# Altium schematic sheet Sheet2_Power_Supply.SchDoc: =ProjectName
size A4; DocumentNumber: 2; SheetNumber: 2; SheetTotal: 5
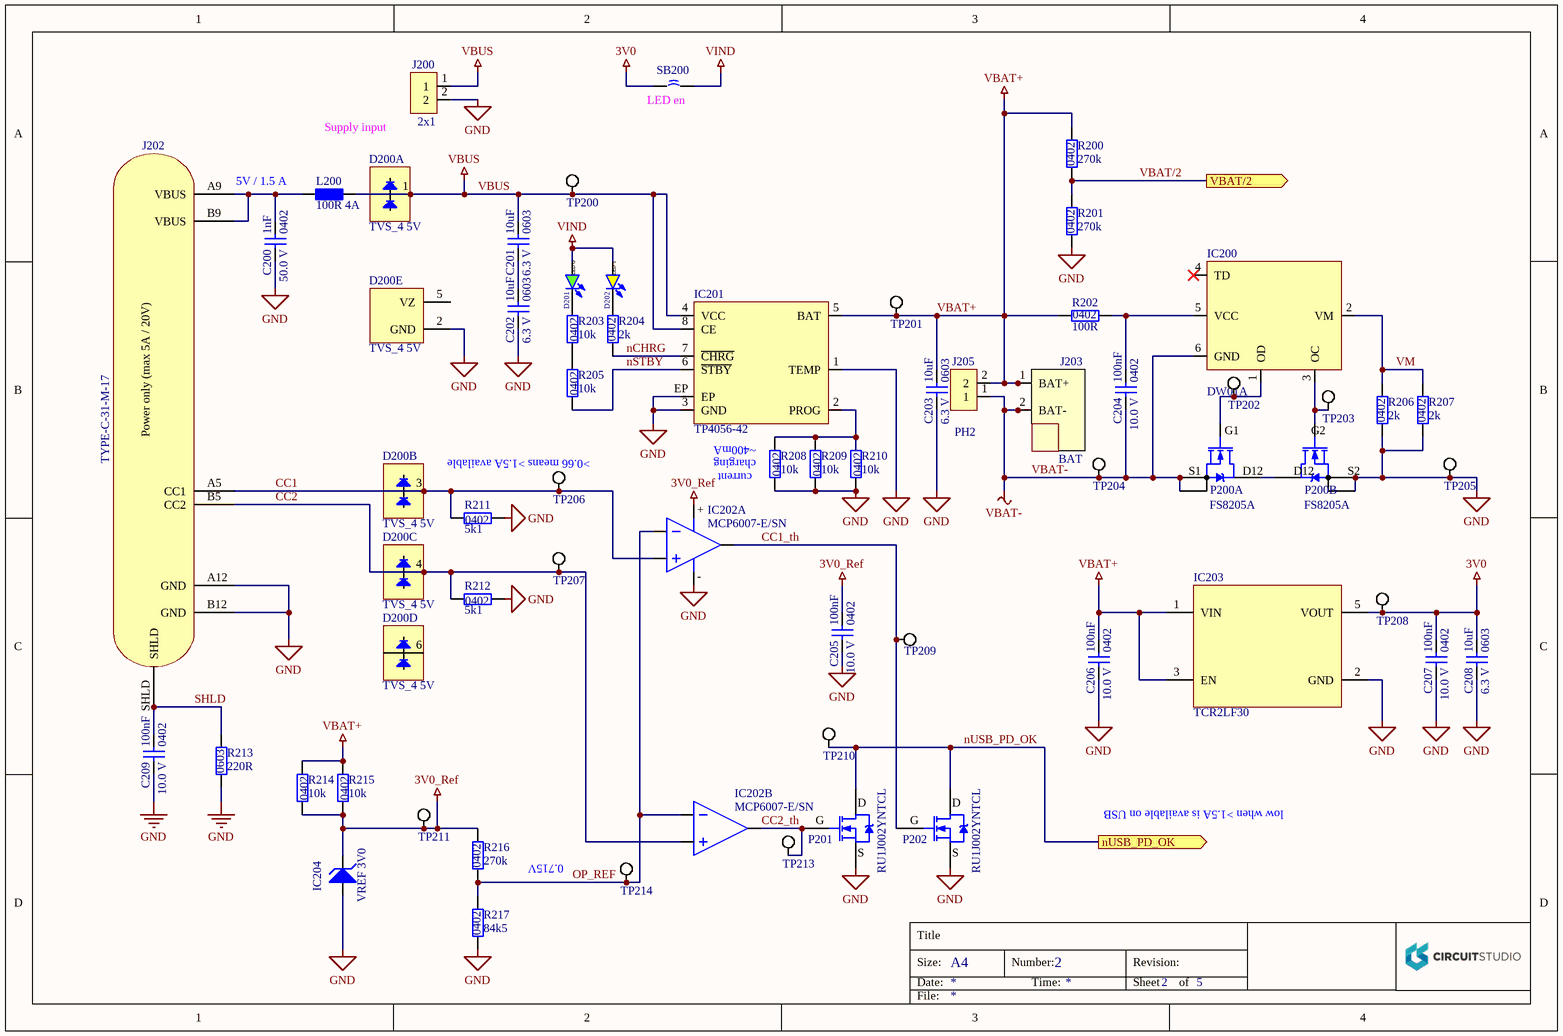
[diagram p0: Sheet2_Power_Supply.SchDoc]

## Parts
C200  Capacitance: 1nF  Footprint: 0402  Voltage: 50.0 V  [C_0402]  (hidden comment: C 1nF 0402 50V)
C201  Capacitance: 10uF  Footprint: 0603  Voltage: 6.3 V  [C_0603]  (hidden comment: C 10uF 0603 6.3V)
C202  Capacitance: 10uF  Footprint: 0603  Voltage: 6.3 V  [C_0603]  (hidden comment: C 10uF 0603 6.3V)
C203  Capacitance: 10uF  Footprint: 0603  Voltage: 6.3 V  [C_0603]  (hidden comment: C 10uF 0603 6.3V)
C204  Capacitance: 100nF  Footprint: 0402  Voltage: 10.0 V  [C_0402]  (hidden comment: C 100nF 0402 10V)
C205  Capacitance: 100nF  Footprint: 0402  Voltage: 10.0 V  [C_0402]  (hidden comment: C 100nF 0402 10V)
C206  Capacitance: 100nF  Footprint: 0402  Voltage: 10.0 V  [C_0402]  (hidden comment: C 100nF 0402 10V)
C207  Capacitance: 100nF  Footprint: 0402  Voltage: 10.0 V  [C_0402]  (hidden comment: C 100nF 0402 10V)
C208  Capacitance: 10uF  Footprint: 0603  Voltage: 6.3 V  [C_0603]  (hidden comment: C 10uF 0603 6.3V)
C209  Capacitance: 100nF  Footprint: 0402  Voltage: 10.0 V  [C_0402]  (hidden comment: C 100nF 0402 10V)
D200  TVS_4 5V  [SOT-23-6]  (parts A,B,C,D,E of 5)
D201  LED G  [LED_0603]
D202  LED Y  [LED_0603]
IC200  DW01A  [SOT-23-6]
IC201  TP4056-42  [SOIC-8-EP]
IC202  MCP6007-E/SN  [SOIC-8]  (parts A,B of 2)
IC203  TCR2LF30  [SOT-23-5]
IC204  VREF 3V0  [SOT-23-3]
J200  2x1  [PH_1x2]
J202  TYPE-C-31-M-17  [Con_TYPE-C-31-M-17]
J203  BAT  [J_BAT_CLIP_18650]
J204  BAT  (value not drawn)  (mechanical)
J205  PH2  [J_S2B-PH-K-S]
L200  Inductance: 100R 4A  [L_1206]  (hidden comment: L Ferrite 100R 4A)
P200  Manufacturer Part Number: FS8205A  [TSSOP-8_4.4mm]  (hidden comment: P2 NMOS 20V 6A)  (parts A,B of 2)
P201  Manufacturer Part Number: RU1J002YNTCL  [UMT3F]  (hidden comment: P_NCH_50V_150mW)
P202  Manufacturer Part Number: RU1J002YNTCL  [UMT3F]  (hidden comment: P_NCH_50V_150mW)
R200  Resistance: 270k  Footprint: 0402  [R_0402]  (hidden comment: R 270k 0402)
R201  Resistance: 270k  Footprint: 0402  [R_0402]  (hidden comment: R 270k 0402)
R202  Resistance: 100R  Footprint: 0402  [R_0402]  (hidden comment: R 100R 0402)
R203  Resistance: 10k  Footprint: 0402  [R_0402]  (hidden comment: R 10k 0402)
R204  Resistance: 2k  Footprint: 0402  [R_0402]  (hidden comment: R 2k 0402)
R205  Resistance: 10k  Footprint: 0402  [R_0402]  (hidden comment: R 10k 0402)
R206  Resistance: 2k  Footprint: 0402  [R_0402]  (hidden comment: R 2k 0402)
R207  Resistance: 2k  Footprint: 0402  [R_0402]  (hidden comment: R 2k 0402)
R208  Resistance: 10k  Footprint: 0402  [R_0402]  (hidden comment: R 10k 0402)
R209  Resistance: 10k  Footprint: 0402  [R_0402]  (hidden comment: R 10k 0402)
R210  Resistance: 10k  Footprint: 0402  [R_0402]  (hidden comment: R 10k 0402)
R211  Resistance: 5k1  Footprint: 0402  [R_0402]  (hidden comment: R 5k1 0402)
R212  Resistance: 5k1  Footprint: 0402  [R_0402]  (hidden comment: R 5k1 0402)
R213  Resistance: 220R  Footprint: 0603  [R_0603]  (hidden comment: R 220R 0603)
R214  Resistance: 10k  Footprint: 0402  [R_0402]  (hidden comment: R 10k 0402)
R215  Resistance: 10k  Footprint: 0402  [R_0402]  (hidden comment: R 10k 0402)
R216  Resistance: 270k  Footprint: 0402  [R_0402]  (hidden comment: R 270k 0402)
R217  Resistance: 84k5  Footprint: 0402  [R_0402]  (hidden comment: R 84k5 0402)
SB200  SB  [SB_2_1mm_nc]  (value not drawn)  (no BOM)
TP200  TP  [TP_1mm]  (value not drawn)  (net tie, no BOM)
TP201  TP  [TP_1mm]  (value not drawn)  (net tie, no BOM)
TP202  TP  [TP_1mm]  (value not drawn)  (net tie, no BOM)
TP203  TP  [TP_1mm]  (value not drawn)  (net tie, no BOM)
TP204  TP  [TP_1mm]  (value not drawn)  (net tie, no BOM)
TP205  TP  [TP_1mm]  (value not drawn)  (net tie, no BOM)
TP206  TP  [TP_1mm]  (value not drawn)  (net tie, no BOM)
TP207  TP  [TP_1mm]  (value not drawn)  (net tie, no BOM)
TP208  TP  [TP_1mm]  (value not drawn)  (net tie, no BOM)
TP209  TP  [TP_1mm]  (value not drawn)  (net tie, no BOM)
TP210  TP  [TP_1mm]  (value not drawn)  (net tie, no BOM)
TP211  TP  [TP_1mm]  (value not drawn)  (net tie, no BOM)
TP213  TP  [TP_1mm]  (value not drawn)  (net tie, no BOM)
TP214  TP  [TP_1mm]  (value not drawn)  (net tie, no BOM)

## Ports
nUSB_PD_OK (out), VBAT/2 (out)

## Nets
3V0: C207.2 C208.2 IC203.5(VOUT) SB200.1 TP208.1(TP)
3V0_Ref: C205.2 IC202.8(VDD) IC204.1(K) R214.1 R215.1 R216.2 TP211.1(TP)
GND: C200.1 C202.1 C203.1 C205.1 C206.1 C207.1 C208.1 C209.1 D200.2(GND) IC201.1(TEMP) IC201.3(GND) IC201.EP IC202.4(VSS) IC203.2(GND) IC204.2(A) J200.2 J202.A12(GND) J202.B12(GND) P200.6(S2) P200.7(S2) P201.2(S) P202.2(S) R201.1 R206.1 R207.1 R208.1 R209.1 R210.1 R211.1 R212.1 R213.1 R217.1 TP205.1(TP)
VBAT+: C203.2 C206.2 IC201.5(BAT) IC203.1(VIN) IC203.3(EN) J203.1(BAT+) J205.2 R200.2 R202.1 R214.2 R215.2 TP201.1(TP)
VBAT-: C204.1 IC200.6(GND) J203.2(BAT-) J205.1 P200.2(S1) P200.3(S1) TP204.1(TP)
VBUS: C201.2 D200.1 IC201.4(VCC) IC201.8(CE) J200.1 L200.2 TP200.1(TP)
VIND: D201.A D202.A SB200.2
CC1: D200.3 IC202.3(INA+) J202.A5(CC1) R211.2 TP206.1(TP)
CC1_th: IC202.1(OUTA) P202.1(G) TP209.1(TP)
CC2: D200.4 IC202.5(INB+) J202.B5(CC2) R212.2 TP207.1(TP)
CC2_th: IC202.7(OUTB) P201.1(G) TP213.1(TP)
nCHRG: IC201.7(~{CHRG}) R204.1
nSTBY: IC201.6(~{STBY}) R205.1
nUSB_PD_OK: P201.3(D) P202.3(D) TP210.1(TP) ; port nUSB_PD_OK
OP_REF: IC202.2(INA-) IC202.6(INB-) R216.1 R217.2 TP214.1(TP)
SHLD: C209.2 J202.SHLD R213.2
VBAT/2: R200.1 R201.2 ; port VBAT/2
VM: IC200.2(VM) R206.2 R207.2
NetC200_2: C200.2 J202.A9(VBUS) J202.B9(VBUS) L200.1
NetC201_1: C201.1 C202.2
NetC204_2: C204.2 IC200.5(VCC) R202.2
NetD201_K: D201.K R203.2
NetD202_K: D202.K R204.2
NetIC200_1: IC200.1(OD) P200.4(G1) TP202.1(TP)
NetIC200_3: IC200.3(OC) P200.5(G1) TP203.1(TP)
NetIC201_2: IC201.2(PROG) R208.2 R209.2 R210.2
NetP200_1: P200.1(D12) P200.8(D12)
NetR203_1: R203.1 R205.2

Not connected (* = marked no-connect by the designer): D200 5(VZ) 6; IC200 4(TD)*

## Notes on the sheet
- (near SB200) LED en
- 5V / 1.5 A
- Supply input
- ~400mA
- (near TP206) >0.66 means >1.5A available
- (near R208) charging
- (near R208) current
- low when >1.5A is available on USB
- 0.715V
- Title
- Size:
- Date:
- A4
- Number:
- Time:
- Revision:
- Sheet
- of
- File:
- (in symbol IC_OpAmp_MCP6007-E/SN, part A) +; -
- (in symbol J_USB-C_2) Power only (max 5A / 20V)
- (in symbol P_2NCH_20V_1W, part B) G2

## Library data of the parts
C200 = CAP_1nF_50V_0402: CAP CER 1000PF 50V C0G/NP0 0402; Manufacturer: Murata Electronics; Manufacturer Part Number: GRM1555C1H102JA01J; Type: Capacitor; Supplier 1: Digi-Key; Supplier Part Number 1: 490-6190-1-ND
C201-C203 C208 = CAP_10uF_6V3_0603: CAP CER 10UF 6.3V X5R 0603; Manufacturer: Taiyo Yuden; Manufacturer Part Number: JMK107ABJ106MA-T; Type: Capacitor; Supplier 1: Digi-Key; Supplier Part Number 1: 587-5869-1-ND
C204-C207 C209 = CAP_100nF_10V_0402: CAP CER 0.1UF 10V X5R 0402; Manufacturer: Samsung Electro-Mechanics; Manufacturer Part Number: CL05A104MP5NNNC; Type: Capacitor; Supplier 1: Digi-Key; Supplier Part Number 1: 1276-1443-1-ND
D200 = D_TVS_U4_12V5: TVS DIODE 5VWM 12.5VC SOT23-6; Manufacturer: Comchip Technology; Manufacturer Part Number: CPDT6-5V0UPC-HF; Type: Diode, TVS; Supplier 1: Digi-Key; Supplier Part Number 1: 641-1829-1-ND
D201 = D_LED_Green_0603: LED GREEN DIFFUSED 0603 SMD; Manufacturer: OSRAM Opto Semiconductors Inc.; Manufacturer Part Number: LT Q39G-Q1OO-25-1; Type: Diode, LED; Supplier 1: Digi-Key; Supplier Part Number 1: 475-3442-1-ND
D202 = D_LED_Yellow_0603: LED YELLOW DIFFUSED; Manufacturer: Stanley Electric Co; Manufacturer Part Number: FKY1111C-TR; Type: Diode, LED; Supplier 1: Digi-Key; Supplier Part Number 1: 404-1273-1-ND
IC200 = IC_BAT_PROT_DW01A: IC BATT MANAGEMENT SOT-23-6; Manufacturer: PUOLOP; Manufacturer Part Number: DW01A; Type: IC; Supplier 1: LCSC; Supplier Part Number 1: C351410
IC201 = IC_BAT_CHGR_TP4056: IC BATT CHG LI-ION 1CELL ESOP-8-EP; Manufacturer: TOPPOWER(Nanjing Extension Microelectronics); Manufacturer Part Number: TP4056-42-ESOP8; Type: IC; Supplier 1: LCSC; Supplier Part Number 1: C16581
IC202 = IC_OpAmp_MCP6007-E/SN: DUAL, 1MHZ OP AMP, E TEMP; Manufacturer: Microchip Technology; Type: IC, OpAmp; Supplier 1: Digi-Key; Supplier Part Number 1: 150-MCP6007-E/SN-ND; Manufacturer Part Number: MCP6007-E/SN
IC203 = IC_Reg_TCR2LF30: IC REG LINEAR 3V 200MA SMV; Manufacturer: Toshiba Semiconductor and Storage; Manufacturer Part Number: TCR2LF30,LM(CT; Type: IC, Regulator; Supplier 1: Digi-Key; Supplier Part Number 1: TCR2LF30LM(CTCT-ND
IC204 = IC_Ref_LM4040DIM3X-3.0: IC VREF SHUNT 1% SOT23-3; Manufacturer: Texas Instruments; Manufacturer Part Number: LM4040DIM3X-3.0/NOPB; Type: IC, Reference; Supplier 1: Digi-Key; Supplier Part Number 1: 296-41429-1-ND
J200 = J_MH2x1_2.54: CONN HEADER VERT 2POS 2.54MM; Manufacturer: Sullins Connector Solutions; Manufacturer Part Number: PRPC002SAAN-RC; Pitch: 2.54; Type: Connector; Supplier 1: Digi-Key; Supplier Part Number 1: S1011EC-02-ND; Pins: 2
J202 = J_USB-C_2: USB4 GEN3, TYPE C, TOP MOUNT; Manufacturer: Korean Hroparts Elec; Manufacturer Part Number: TYPE-C-31-M-17; Type: Connector; Supplier 1: LCSC; Supplier Part Number 1: C283540; Pins: 6; Pitch: *
J203 = J_BAT_CLIP_18650_A: SMT Battery Connectors 18650; Manufacturer: MYOUNG; Manufacturer Part Number: MY-18650-02; Type: other; Supplier 1: LCSC; Supplier Part Number 1: C2979182; Pins: 2
J204 = J_BAT_CLIP_18650_B: SMT Battery Connectors 18650; Manufacturer: MYOUNG; Manufacturer Part Number: MY-18650-02; Type: other; Supplier 1: LCSC; Supplier Part Number 1: C2979182; Pins: 2
J205 = J_S2B-PH-KL: CONN HEADER R/A 2POS 2MM; Manufacturer: JST Sales America Inc.; Manufacturer Part Number: S2B-PH-KL(LF)(SN); Pitch: 2; Type: Connector; Supplier 1: LCSC; Supplier Part Number 1: C160237; Pins: 2
L200 = L_100R_4A: FIXED IND 100 4000MA 1206; Manufacturer: Eaton - Electronics Division; Manufacturer Part Number: MFBM1V3216-101-R; Type: Inductor, Ferrite; Supplier 1: Digi-Key; Supplier Part Number 1: 283-MFBM1V3216-101-RCT-ND
P200 = P_2NCH_20V_1W: MOSFET 2N_CH 20V 6A TSSOP-8; Manufacturer: Fortune Semicon; Type: Transistor; Supplier 1: LCSC; Supplier Part Number 1: C16052
P201 P202 = P_NCH_50V_150mW: MOSFET N-CH 50V 200MA UMT3F; Manufacturer: Rohm Semiconductor; Type: Transistor; Supplier 1: Digi-Key; Supplier Part Number 1: RU1J002YNTCLCT-ND
R200 R201 R216 = R_270k_0402: RES 270K OHM 1% 1/16W 0402; Manufacturer: YAGEO; Manufacturer Part Number: RC0402FR-07270KL; Type: Resistor; Supplier 1: Digi-Key; Supplier Part Number 1: 311-270KLRCT-ND
R202 = R_100R_0402: RES 100 OHM 1% 1/16W 0402; Manufacturer: Stackpole Electronics Inc; Manufacturer Part Number: RMCF0402FT100R; Type: Resistor; Supplier 1: Digi-Key; Supplier Part Number 1: RMCF0402FT100RCT-ND
R203 R205 R208-R210 R214 R215 = R_10k_0402: RES 10K OHM 1% 1/16W 0402; Manufacturer: YAGEO; Manufacturer Part Number: RC0402FR-0710KL; Type: Resistor; Supplier 1: Digi-Key; Supplier Part Number 1: 311-10.0KLRCT-ND
R204 R206 R207 = R_2k_0402: RES 2K OHM 1% 1/16W 0402; Manufacturer: Stackpole Electronics Inc; Manufacturer Part Number: RMCF0402FT2K00; Type: Resistor; Supplier 1: Digi-Key; Supplier Part Number 1: RMCF0402FT2K00CT-ND
R211 R212 = R_5k1_0420: RES 5.1K OHM 1% 1/16W 0402; Manufacturer: Stackpole Electronics Inc; Manufacturer Part Number: RMCF0402FT5K10; Type: Resistor; Supplier 1: Digi-Key; Supplier Part Number 1: RMCF0402FT5K10CT-ND
R213 = R_220R_0603: RES 220 OHM 1% 1/10W 0603; Manufacturer: Stackpole Electronics Inc; Manufacturer Part Number: RMCF0603FT220R; Type: Resistor; Supplier 1: Digi-Key; Supplier Part Number 1: RMCF0603FT220RCT-ND
R217 = R_84k5_0402: RES SMD 84.5K OHM 1% 1/16W 0402; Manufacturer: Vishay Dale; Manufacturer Part Number: CRCW040284K5FKED; Type: Resistor; Supplier 1: Digi-Key; Supplier Part Number 1: 541-84.5KLCT-ND
SB200 = SB_sel2_1mm_nc: Solder Bridge sel2, normally closed; Type: Connector,SB; Pins: 2
TP200-TP211 TP213 TP214 = TP_1mm: Test Point 1mm